# Altium schematic sheet rock.SchDoc
size A4
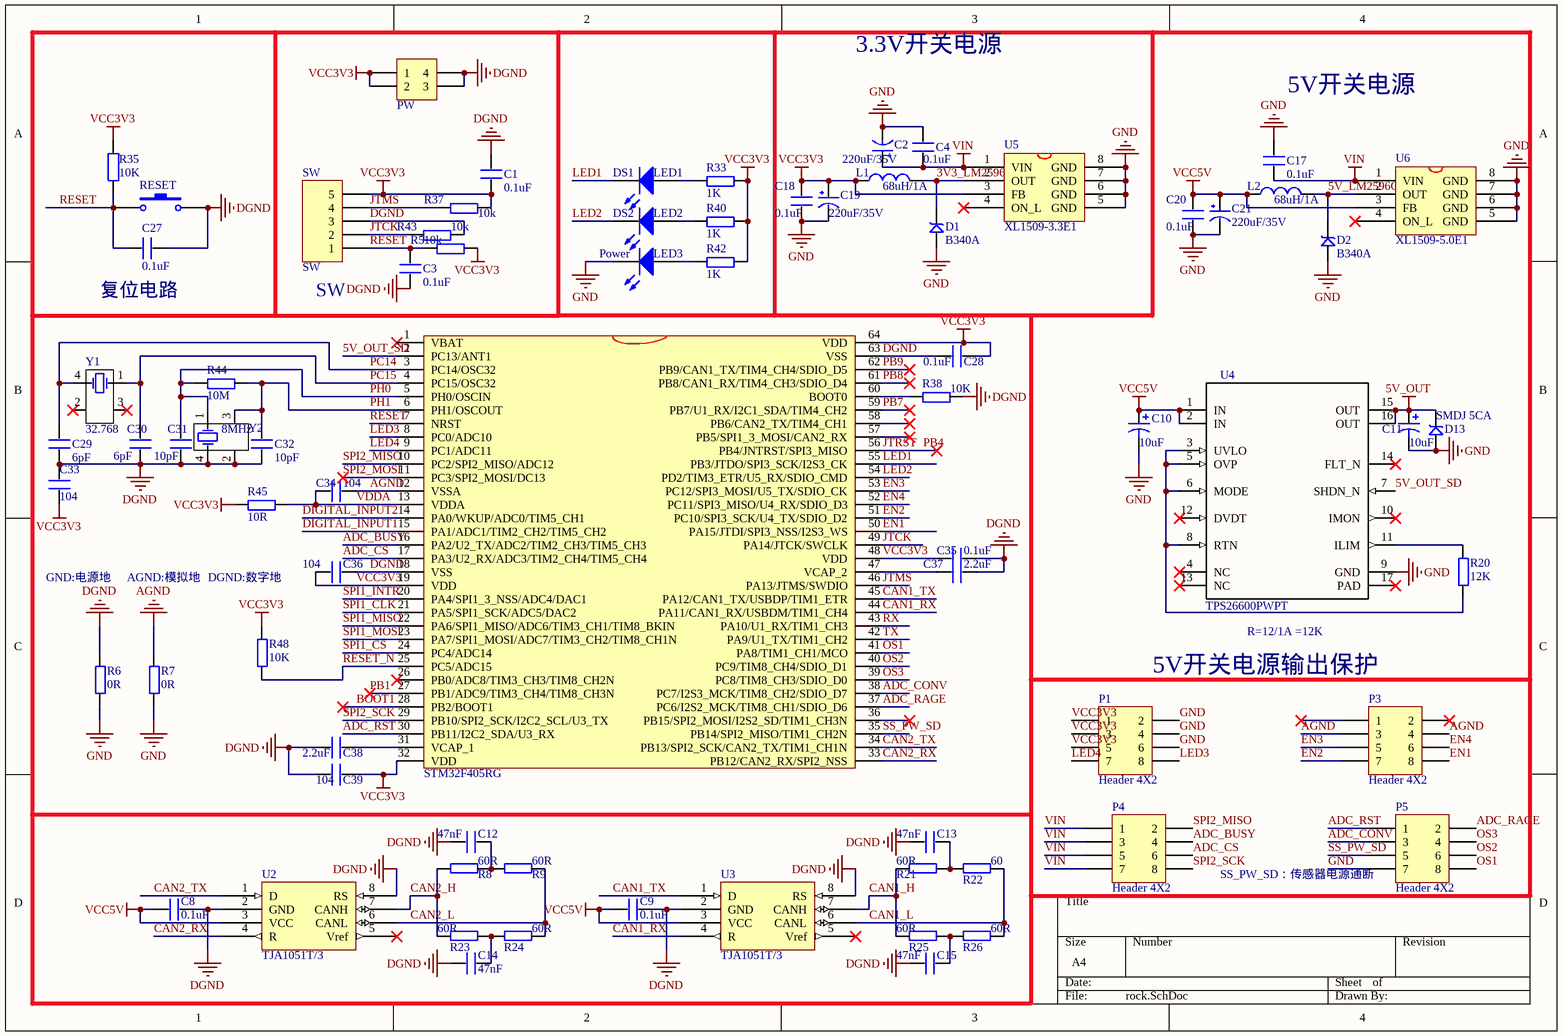
[diagram p0: rock.SchDoc]

## Parts
C1  0.1uF  [0603]
C2  220uF/35V  [C-RB-S8]
C3  0.1uF  [0603]
C4  0.1uF  [0603]
C8  0.1uF  [0603]
C9  0.1uF  [0603]
C10  value 10uF  [CAP-3216]  (hidden comment: Cap Pol3)
C11  value 10uF  [CAP-3216]  (hidden comment: Cap Pol3)
C12  47nF  [0603]
C13  47nF  [0603]
C14  47nF  [0603]
C15  47nF  [0603]
C17  0.1uF  [0603]
C18  0.1uF  [0603]
C19  220uF/35V  [C-RB-S8]
C20  0.1uF  [0603]
C21  220uF/35V  [C-RB-S8]
C27  0.1uF  [0603]
C28  0.1uF  [0603]
C29  6pF  [0603]
C30  6pF  [0603]
C31  10pF  [0603]
C32  10pF  [0603]
C33  104  [0603]
C34  104  [0603]
C35  0.1uF  [0603]
C36  104  [0603]
C37  2.2uF  [0603]
C38  2.2uF  [0603]
C39  104  [0603]
D1  B340A  [DO-214AC]
D2  B340A  [DO-214AC]
D13  SMDJ 5CA  [SMC]
DS1  LED1  [0603]
DS2  LED2  [0603]
L1  value 68uH/1A  [6045]  (hidden comment: SWPA6045S680MT)
L2  value 68uH/1A  [6045]  (hidden comment: SWPA6045S680MT)
P1  Header 4X2  [HDR4X2_A_Tiepian]
P3  Header 4X2  [HDR4X2_A_Tiepian]
P4  Header 4X2  [HDR4X2_A_Tiepian]
P5  Header 4X2  [HDR4X2_A_Tiepian]
Power  LED3  [0603]
PW  Header 2X2A  [HDR2X2_A]  (value not drawn)
R5  10k  [0603]
R6  0R  [0603]
R7  0R  [0603]
R8  120R  [0603]  (value not drawn)
R9  120R  [0603]  (value not drawn)
R20  12K  [0603]
R21  120R  [0603]  (value not drawn)
R22  120R  [0603]  (value not drawn)
R23  120R  [0603]  (value not drawn)
R24  120R  [0603]  (value not drawn)
R25  120R  [0603]  (value not drawn)
R26  120R  [0603]  (value not drawn)
R33  1K  [0603]
R35  10K  [0603]
R37  10k  [0603]
R38  10K  [0603]
R40  1K  [0603]
R42  1K  [0603]
R43  10k  [0603]
R44  10M  [0603]
R45  10R  [0603]
R48  10K  [0603]
RESET  SW-PB  [SW_PB2_A2]  (value not drawn)
STM32F405RG  STM  [LQFP-64]  (value not drawn)
SW  SW  [HDR5X1_SW _Tiepian]
U2  TJA1051T/3  [SOP-8]
U3  TJA1051T/3  [SOP-8]
U4  TPS26600PWPT  [PWP0016H_N]
U5  XL1509-3.3E1  [SOIC8_N]
U6  XL1509-5.0E1  [SOIC8_N]
Y1  value 32.768  [XTAL_8x3.8]  (hidden comment: MC306)
Y2  value 8MHz  [XTAL_5x3.2]  (hidden comment: ABM3B-8.000MHZ-10-1-U-T)

## Nets
5V_OUT: C11.1 D13.2 U4.15(OUT) U4.16(OUT)
AGND: C34.1 P3.3 P3.4 R7.2 STM32F405RG.12(VSSA)
DGND: C1.1 C3.1 C8.1 C9.1 C12.2 C13.2 C14.2 C15.2 C27.2 C28.1 C29.1 C30.1 C31.1 C32.1 C33.2 C35.2 C36.2 C37.2 C38.1 C39.1 PW.3 PW.4 R6.2 R38.2 R43.2 RESET.2 STM32F405RG.18(VSS) STM32F405RG.63(VSS) SW.3 U2.2(GND) U2.8(RS) U3.2(GND) U3.8(RS) Y2.2(NC) Y2.4(OSC1)
GND: C2.2(GND) C4.1 C10.2 C11.2 C17.1 C18.1 C19.2(GND) C20.1 C21.2(GND) D1.1 D2.1 D13.1 P1.2 P1.4 P1.6 P5.7 Power.2(K) R6.1 R7.1 U4.9(GND) U5.5(GND) U5.6(GND) U5.7(GND) U5.8(GND) U6.5(GND) U6.6(GND) U6.7(GND) U6.8(GND)
VCC3V3: C1.2 C18.2 C19.1(VCC) C28.2 C33.1 C35.1 C36.1 C39.2 L1.1 P1.1 P1.3 P1.5 PW.1 PW.2 R5.2 R33.2 R35.2 R37.2 R40.2 R42.2 R45.1 R48.2 STM32F405RG.19(VDD) STM32F405RG.32(VDD) STM32F405RG.48(VDD) STM32F405RG.64(VDD) SW.5 U5.3(FB)
VCC5V: C8.2 C9.2 C10.1 C20.2 C21.1(VCC) L2.1 U2.3(VCC) U3.3(VCC) U4.1(IN) U4.2(IN) U6.3(FB)
VIN: C2.1(VCC) C4.2 C17.2 P4.1 P4.3 P4.5 P4.7 U5.1(VIN) U6.1(VIN)
3V3_LM2596OUT: D1.2 L1.2 U5.2(OUT)
5V_LM2596OUT: D2.2 L2.2 U6.2(OUT)
5V_OUT_SD: STM32F405RG.2(PC13/ANT1) U4.7(SHDN_N)
ADC_BUSY: P4.4 STM32F405RG.16(PA2/U2_TX/ADC2/TIM2_CH3/TIM5_CH3)
ADC_CONV: P5.3 STM32F405RG.38(PC7/I2S3_MCK/TIM8_CH2/SDIO_D7)
ADC_CS: P4.6 STM32F405RG.17(PA3/U2_RX/ADC3/TIM2_CH4/TIM5_CH4)
ADC_RAGE: P5.2 STM32F405RG.37(PC6/I2S2_MCK/TIM8_CH1/SDIO_D6)
ADC_RST: P5.1 STM32F405RG.30(PB11/I2C2_SDA/U3_RX)
BOOT1: STM32F405RG.28(PB2/BOOT1)
CAN1_H: R21.2 R25.2 U3.7(CANH)
CAN1_L: R22.1 R26.1 U3.6(CANL)
CAN1_RX: STM32F405RG.44(PA11/CAN1_RX/USBDM/TIM1_CH4) U3.4(R)
CAN1_TX: STM32F405RG.45(PA12/CAN1_TX/USBDP/TIM1_ETR) U3.1(D)
CAN2_H: R8.2 R23.2 U2.7(CANH)
CAN2_L: R9.1 R24.1 U2.6(CANL)
CAN2_RX: STM32F405RG.33(PB12/CAN2_RX/SPI2_NSS) U2.4(R)
CAN2_TX: STM32F405RG.34(PB13/SPI2_SCK/CAN2_TX/TIM1_CH1N) U2.1(D)
DIGITAL_INPUT1: STM32F405RG.15(PA1/ADC1/TIM2_CH2/TIM5_CH2)
DIGITAL_INPUT2: STM32F405RG.14(PA0/WKUP/ADC0/TIM5_CH1)
EN1: P3.8 STM32F405RG.50(PA15/JTDI/SPI3_NSS/I2S3_WS)
EN2: P3.7 STM32F405RG.51(PC10/SPI3_SCK/U4_TX/SDIO_D2)
EN3: P3.5 STM32F405RG.53(PC12/SPI3_MOSI/U5_TX/SDIO_CK)
EN4: P3.6 STM32F405RG.52(PC11/SPI3_MISO/U4_RX/SDIO_D3)
JTCK: R43.1 STM32F405RG.49(PA14/JTCK/SWCLK) SW.2
JTMS: R37.1 STM32F405RG.46(PA13/JTMS/SWDIO) SW.4
JTRST: STM32F405RG.56(PB4/JNTRST/SPI3_MISO)  [also labelled PB4]
LED1: DS1.2(K) STM32F405RG.55(PB3/JTDO/SPI3_SCK/I2S3_CK)
LED2: DS2.2(K) STM32F405RG.54(PD2/TIM3_ETR/U5_RX/SDIO_CMD)
LED3: P1.8 STM32F405RG.8(PC0/ADC10)
LED4: P1.7 STM32F405RG.9(PC1/ADC11)
OS1: P5.8 STM32F405RG.41(PA8/TIM1_CH1/MCO)
OS2: P5.6 STM32F405RG.40(PC9/TIM8_CH4/SDIO_D1)
OS3: P5.4 STM32F405RG.39(PC8/TIM8_CH3/SDIO_D0)
PB1: STM32F405RG.27(PB1/ADC9/TIM3_CH4/TIM8_CH3N)
PB7: STM32F405RG.59(PB7/U1_RX/I2C1_SDA/TIM4_CH2)
PB8: STM32F405RG.61(PB8/CAN1_RX/TIM4_CH3/SDIO_D4)
PB9: STM32F405RG.62(PB9/CAN1_TX/TIM4_CH4/SDIO_D5)
PC14: C29.2 STM32F405RG.3(PC14/OSC32) Y1.4(OSC1)
PC15: C30.2 STM32F405RG.4(PC15/OSC32) Y1.1(OSC2)
PH0: C31.2 R44.1 STM32F405RG.5(PH0/OSCIN) Y2.1(OSC2)
PH1: C32.2 R44.2 STM32F405RG.6(PH1/OSCOUT) Y2.3(NC)
RESET: C3.2 C27.1 R5.1 R35.1 RESET.1 STM32F405RG.7(NRST) SW.1
RESET_N: R48.1 STM32F405RG.25(PC5/ADC15)
RX: STM32F405RG.43(PA10/U1_RX/TIM1_CH3)
SPI1_CLK: STM32F405RG.21(PA5/SPI1_SCK/ADC5/DAC2)
SPI1_CS: STM32F405RG.24(PC4/ADC14)
SPI1_INTR: STM32F405RG.20(PA4/SPI1_3_NSS/ADC4/DAC1)
SPI1_MISO: STM32F405RG.22(PA6/SPI1_MISO/ADC6/TIM3_CH1/TIM8_BKIN)
SPI1_MOSI: STM32F405RG.23(PA7/SPI1_MOSI/ADC7/TIM3_CH2/TIM8_CH1N)
SPI2_MISO: P4.2 STM32F405RG.10(PC2/SPI2_MISO/ADC12)
SPI2_MOSI: STM32F405RG.11(PC3/SPI2_MOSI/DC13)
SPI2_SCK: P4.8 STM32F405RG.29(PB10/SPI2_SCK/I2C2_SCL/U3_TX)
SS_PW_SD: P5.5 STM32F405RG.35(PB14/SPI2_MISO/TIM1_CH2N)
TX: STM32F405RG.42(PA9/U1_TX/TIM1_CH2)
VDDA: C34.2 R45.2 STM32F405RG.13(VDDA)
NetC12_1: C12.1 R8.1 R9.2
NetC13_1: C13.1 R21.1 R22.2
NetC14_1: C14.1 R23.1 R24.2
NetC15_1: C15.1 R25.1 R26.2
NetC37_1: C37.1 STM32F405RG.47(VCAP_2)
NetC38_2: C38.2 STM32F405RG.31(VCAP_1)
NetDS1_1: DS1.1(A) R33.1
NetDS2_1: DS2.1(A) R40.1
NetPower_1: Power.1(A) R42.1
NetR20_1: R20.1 U4.3(UVLO) U4.5(OVP) U4.6(MODE) U4.8(RTN)
NetR20_2: R20.2 U4.11(ILIM)
NetR38_1: R38.1 STM32F405RG.60(BOOT0)

Not connected (* = marked no-connect by the designer): P3 1* 2*; STM32F405RG 1(VBAT)* 26(PB0/ADC8/TIM3_CH3/TIM8_CH2N)* 36(PB15/SPI2_MOSI/I2S2_SD/TIM1_CH3N)* 57(PB5/SPI1_3_MOSI/CAN2_RX)* 58(PB6/CAN2_TX/TIM4_CH1)*; U2 5(Vref)*; U3 5(Vref)*; U4 4(NC)* 10(IMON)* 12(DVDT)* 13(NC)* 14(FLT_N)* 17(PAD)*; U5 4(ON_L)*; U6 4(ON_L)*; Y1 2(NC)* 3(NC)*

## Notes on the sheet
- 3.3V开关电源
- 5V开关电源
- (near C27) 复位电路
- (near SW) SW
- GND:电源地
- AGND:模拟地
- DGND:数字地
- (near U4) R=12/1A =12K
- (near P1) 5V开关电源输出保护
- SS_PW_SD：传感器电源通断
- (in symbol R) 60R; 60

## Library data of the parts
C1 C3 C4 C8 C9 C12-C15 C17 C18 C20 C27-C39 = C
C2 C19 C21 = CAP
C10 C11 = Cap Pol3: Polarized Capacitor (Surface Mount); Published: 8-Jun-2000; LatestRevisionDate: 29-May-2009; LatestRevisionNote: IPC-7351 Footprint Added.; PackageReference: C0805; Publisher: Altium Limited; PackageDescription: Chip Capacitor
D1 D2 = SMBJ: TVS
D13 = SMBJ 6.5CA: SMDJ5.0CA; Terabits Part Number: 1D-0000001-XX; Manufacture: LRC; Part Type: Diode; Manufacture Part Number: SMBJ 6.5CA
DS1 DS2 Power = LED2: Typical RED, GREEN, YELLOW, AMBER GaAs LED; Published: 8-Jun-2000; LatestRevisionDate: 17-Jul-2002; LatestRevisionNote: Re-released for DXP Platform.; PackageDocument: Feb-2002; PackageReference: 3.2X1.6X1.1; Publisher: Altium Limited
L1 L2 = Inductor: 电感; Code_IEC: 1005; Published: 8-Jun-2000; LatestRevisionDate: 17-Jul-2002; LatestRevisionNote: Re-released for DXP Platform.; PackageReference: 0402-A; Publisher: Altium Limited; Code_JEITA: 0402
P1 P3-P5 = Header 4X2: 接插件; LatestRevisionDate: 17-Jul-2002; LatestRevisionNote: Re-released for DXP Platform.; Publisher: Altium Limited
PW = Header 2X2A: 接插件; LatestRevisionDate: 17-Jul-2002; LatestRevisionNote: Re-released for DXP Platform.; Publisher: Altium Limited
R5 R8 R9 R20-R26 R33 R37 R38 R40 R42-R45 R48 = R
R6 R7 = R_1K: Res,1K,0603; TPN: 1R-0000008-XX
R35 = Res1: 贴片电阻; Published: 8-Jun-2000; LatestRevisionDate: 17-Jul-2002; LatestRevisionNote: Re-released for DXP Platform.; PackageReference: AXIAL-0.4; Publisher: Altium Limited; Value: 10K
RESET = SW-PB: 微动开关; Published: 24-Mar-1999; LatestRevisionDate: 17-Jul-2002; LatestRevisionNote: Re-released for DXP Platform.; PackageReference: SPST-2; Publisher: Altium Limited
STM32F405RG = STM32F405RG: STM32F405RG_64Pins; Published: 8-Jun-2000; LatestRevisionDate: 17-Jul-2002; LatestRevisionNote: Re-released for DXP Platform.; PackageReference: RAD-0.3; Publisher: Altium Limited
SW = Header 5: XH插座 1*5P 2.54mm; LatestRevisionDate: 17-Jul-2002; LatestRevisionNote: Re-released for DXP Platform.; Publisher: Altium Limited
U2 U3 = SN65HVD230D
U4 = TPS26600PWPR: Manufacturer: Texas Instruments; PartNumber: TPS26600PWPR; RefDes: RefDes; TYPE: TYPE; Value: Value
U5 U6 = XL1509-3.3V/5V/12V
Y1 = XTAL_8x3.8: Q13MC3062000600
Y2 = XTAL_8x3.8: ABM3B-8.000MHZ/10pF